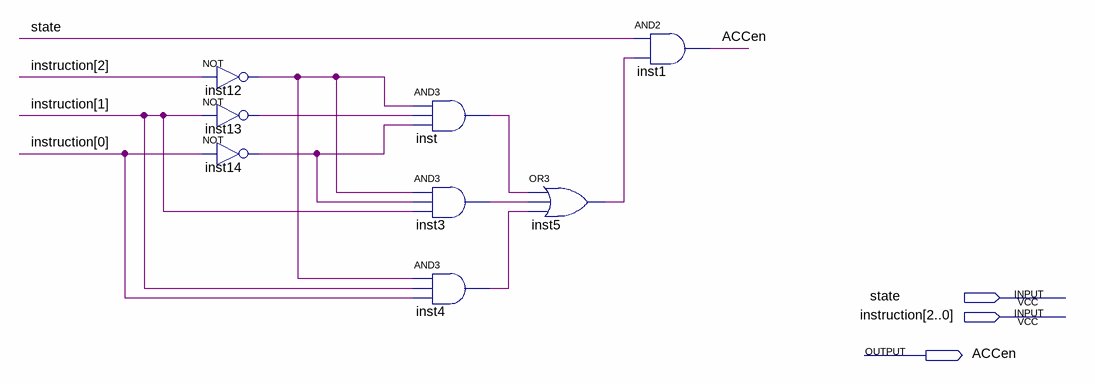
[diagram p0: schematic sheet]
// Quartus schematic controler_acc_enable.bdf as structural Verilog: 8 symbols, 3 pins
module controler_acc_enable (
  input  state,
  input  [2:0] instruction,
  output ACCen
);

  wire inst3_out, inst4_out, inst5_out, inst12_out, inst13_out, inst14_out, inst_out;

  not inst12 (inst12_out, instruction[2]);
  not inst13 (inst13_out, instruction[1]);
  not inst14 (inst14_out, instruction[0]);
  and inst (inst_out, inst12_out, inst13_out, inst14_out);
  and inst3 (inst3_out, inst12_out, inst14_out, instruction[1]);
  and inst4 (inst4_out, inst12_out, instruction[1], instruction[0]);
  or inst5 (inst5_out, inst_out, inst3_out, inst4_out);
  and inst1 (ACCen, state, inst5_out);
endmodule
